# EasyEDA Pro project ProProject_Hi3861_v2.1_2024-07-26.epro, schematic Schematic1

## Sheets
1 P1: Create Date: 2024-06-16; Page Name: P1; Project Name: Hi3861_v2.0; Schematic Name: Schematic1; Update Date: 2024-06-25; Company: 嘉立创EDA; Page Size: A4; Version: V1.0
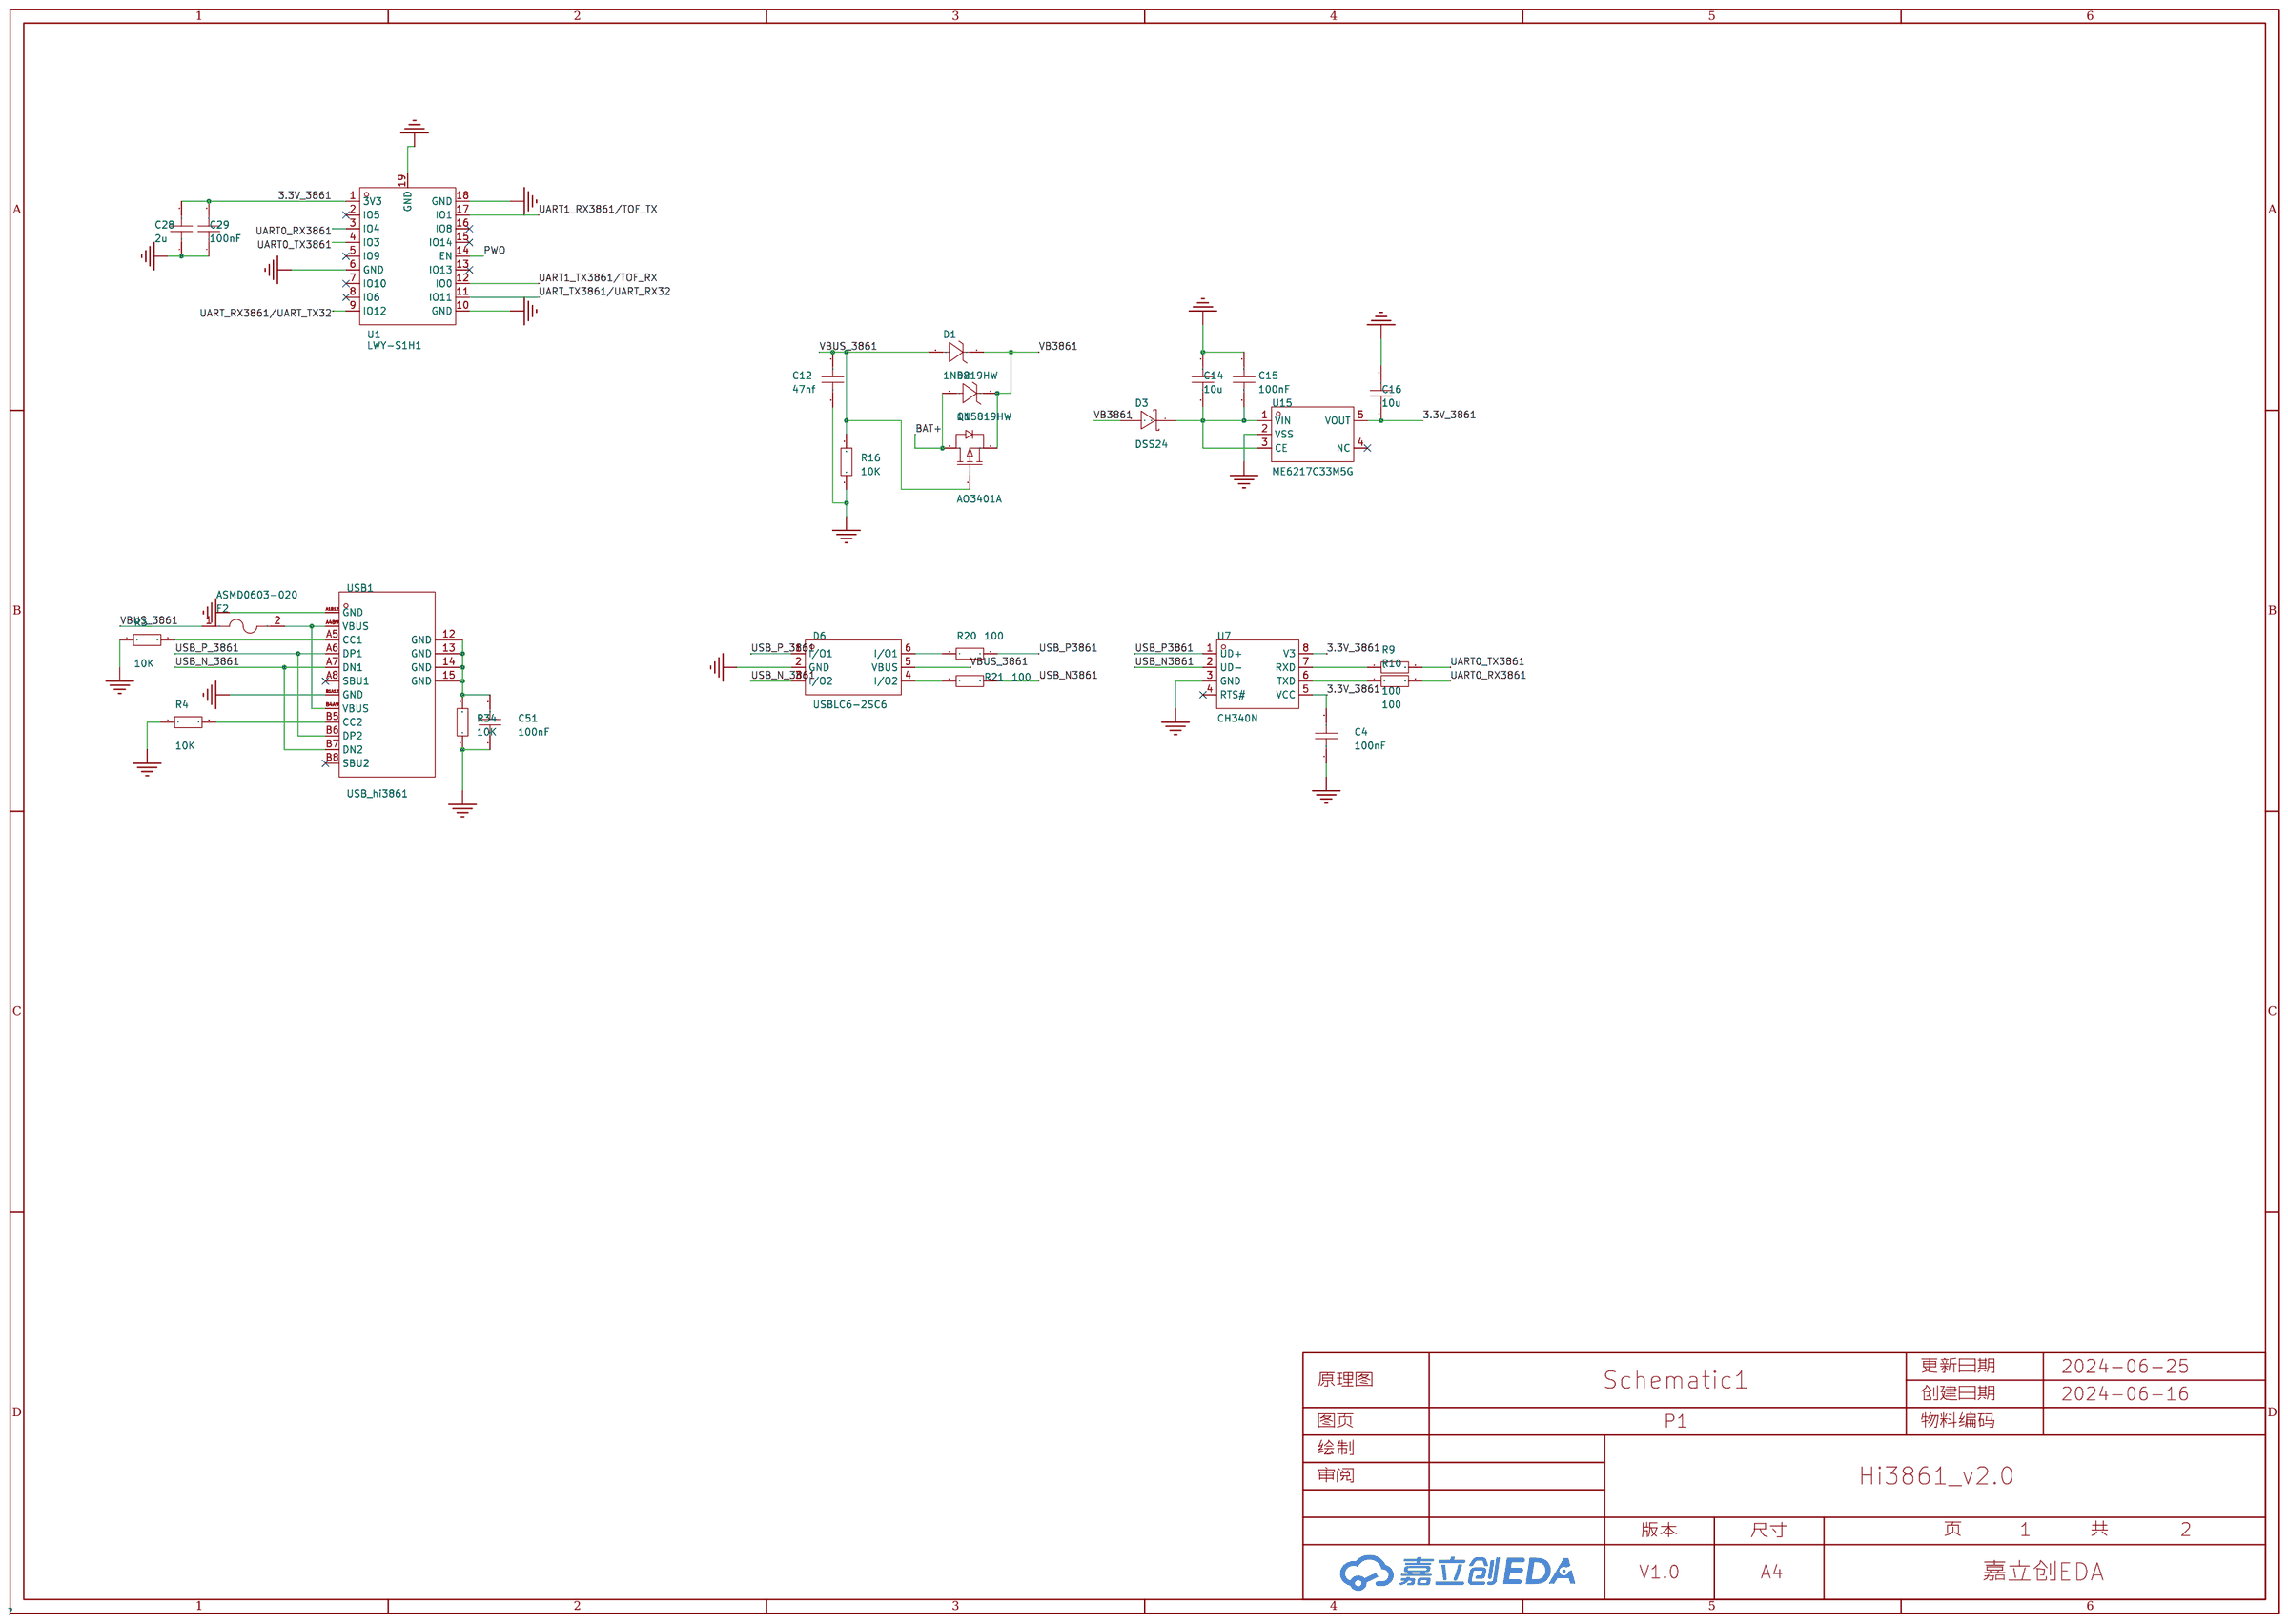
[diagram p0: P1]
2 P2: Create Date: 2024-07-16; Page Name: P2; Project Name: Hi3861_v2.1; Update Date: 2024-07-25
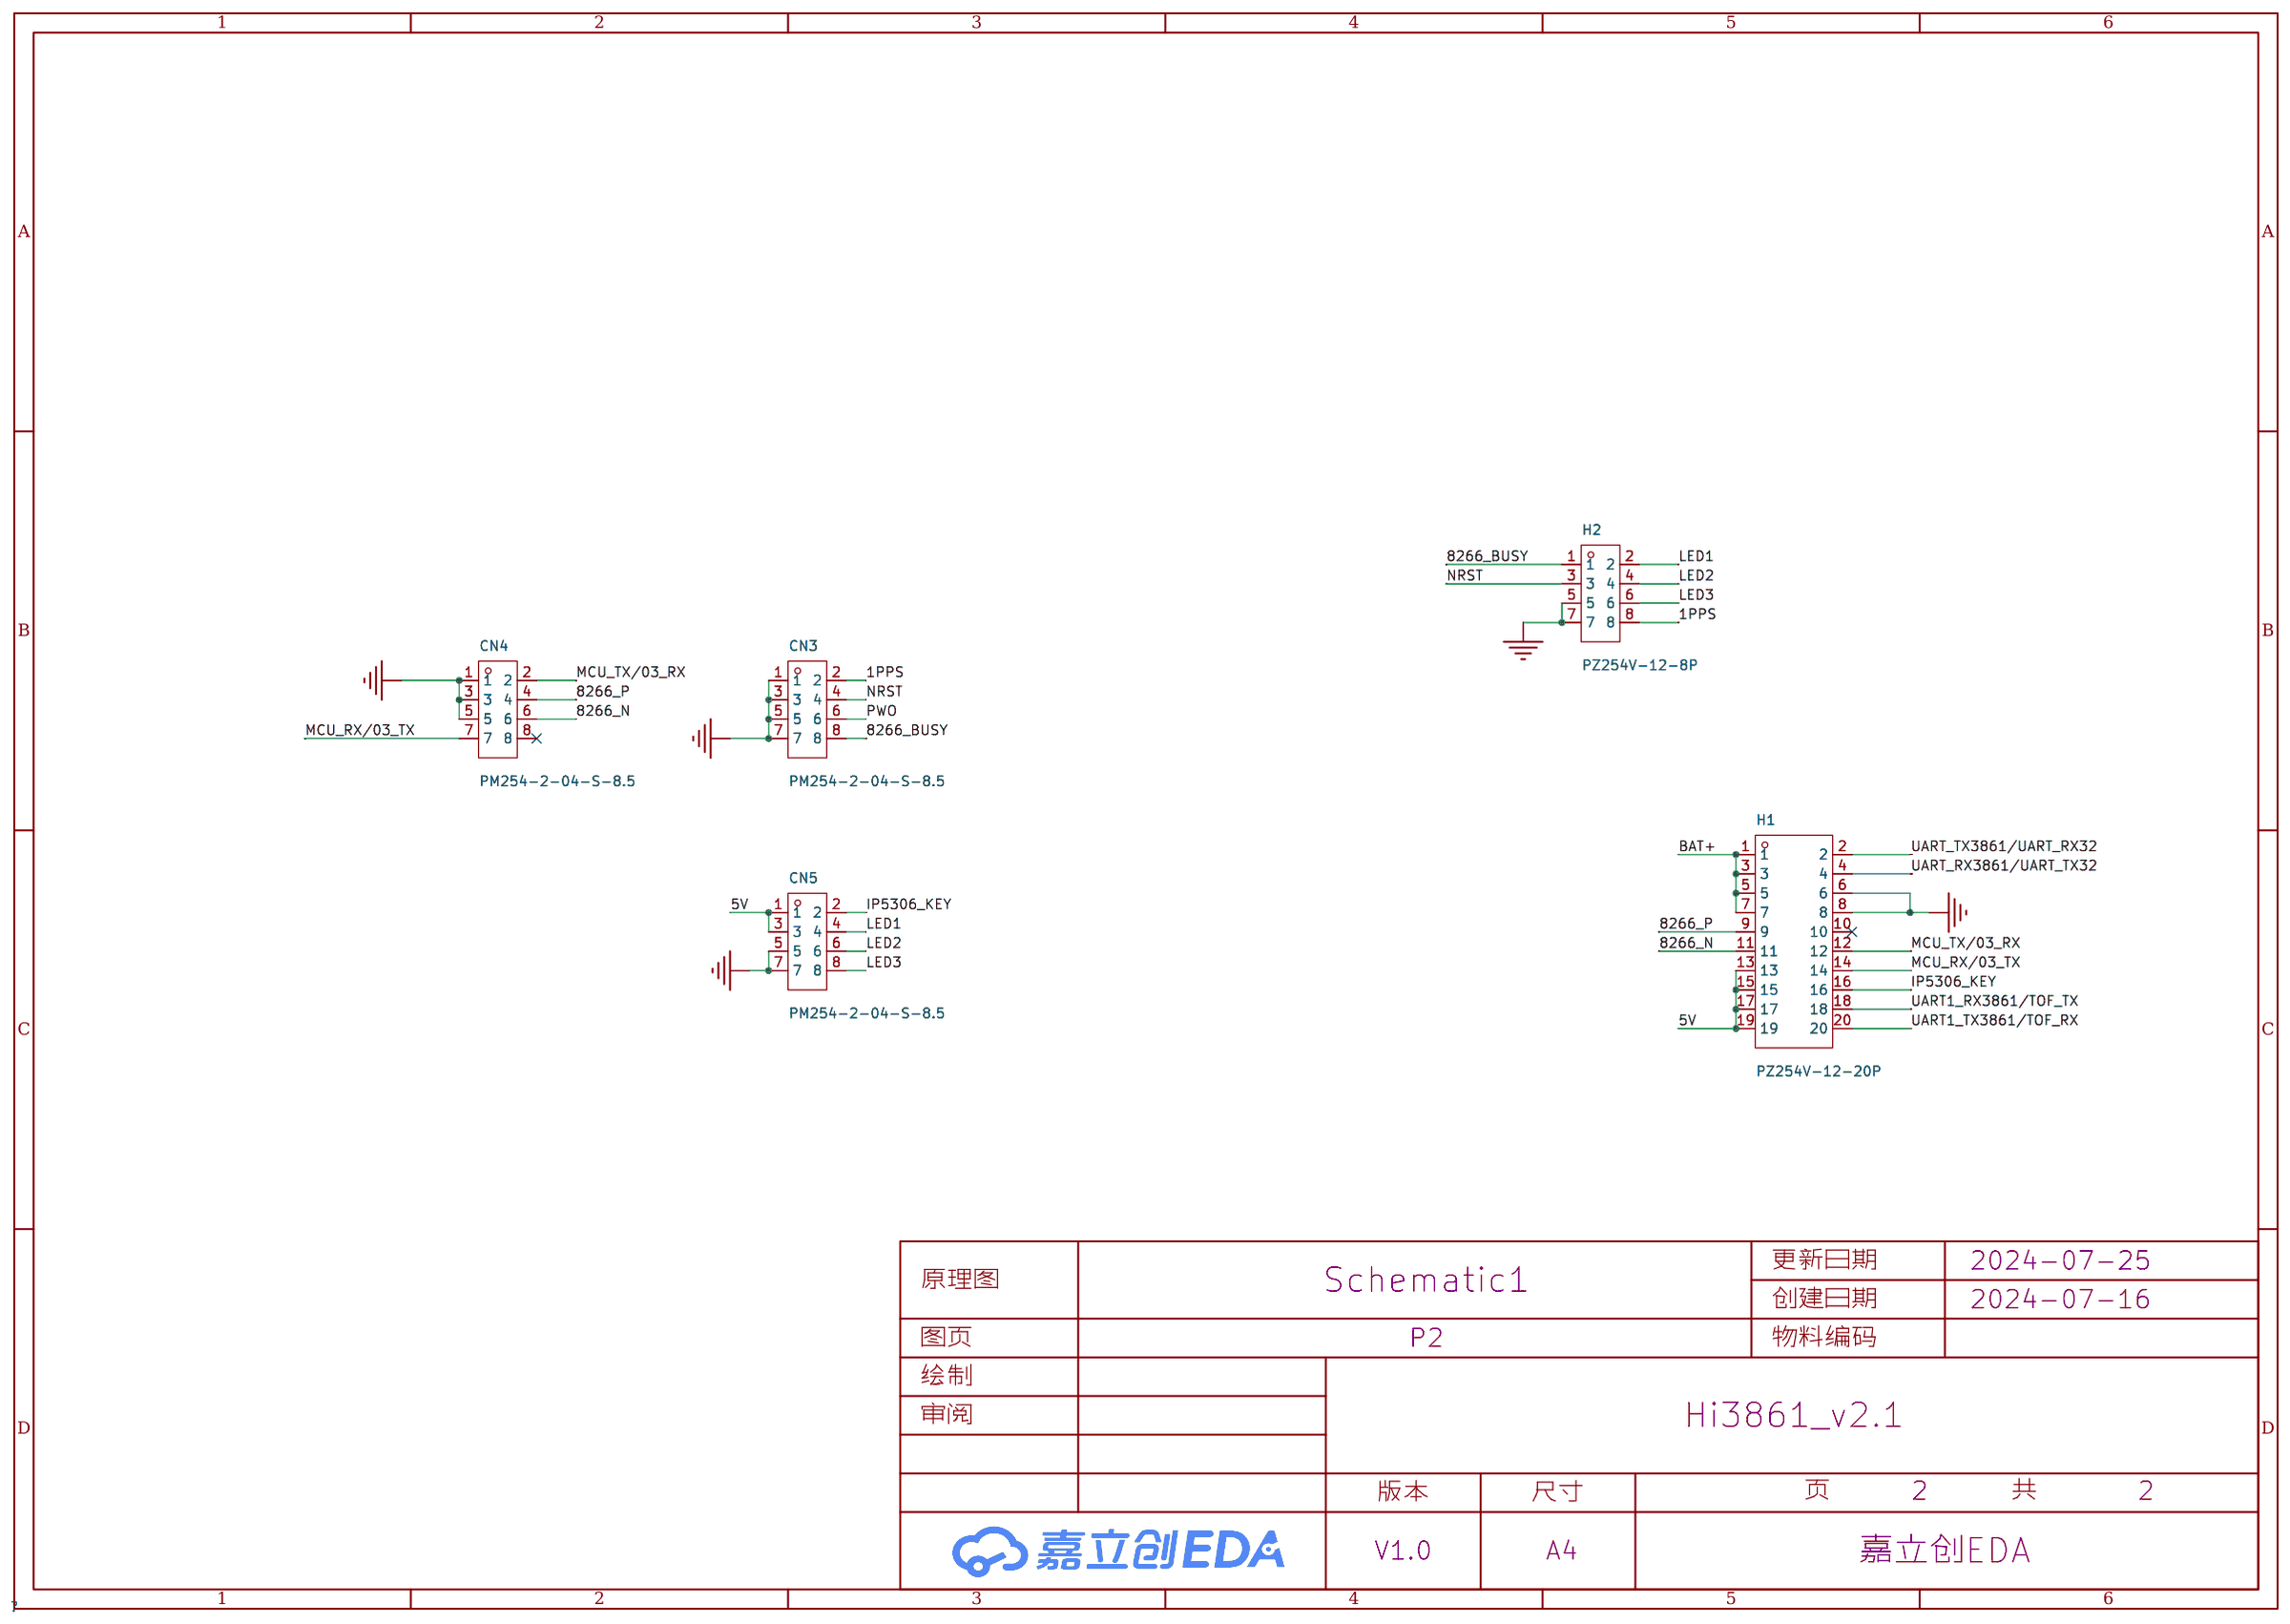
[diagram p1: P2]

## Parts
sheet P1
C4  100nF  [C0402]
C12  47nf  [C0402]
C14  10u  [C0402]
C15  100nF  [C0402]
C16  10u  [C0402]
C28  2u  [C0402]
C29  100nF  [C0402]
C51  100nF  [C0402]
D1  1N5819HW  [SOD-123_L2.7-W1.6-LS3.7-RD-1]
D2  1N5819HW  [SOD-123_L2.7-W1.6-LS3.7-RD-1]
D3  DSS24  [SOD-123_L2.8-W1.8-LS3.7-RD]
D6  USBLC6-2SC6  [SOT-23-6_L2.9-W1.6-P0.95-LS2.8-BL]
F2  ASMD0603-020  [F0603]
Q1  AO3401A  [SOT-23_L2.9-W1.3-P1.90-LS2.4-BR]
R3  10K  [R0402]
R4  10K  [R0402]
R9  100  [R0402]
R10  100  [R0402]
R16  10K  [R0402]
R20  100  [R0402]
R21  100  [R0402]
R34  10K  [R0402]
U1  LWY-S1H1  [WIFIM-SMD_L18.4-W15.0_LWY-S1H1]
U7  CH340N  [SOP-8_L4.9-W3.9-P1.27-LS6.0-BL]
U15  ME6217C33M5G  [SOT-23-5_L3.0-W1.7-P0.95-LS2.8-BR]
USB1  USB_hi3861  [USB-SMD_TYPEC-16PIN]
sheet P2
CN3  PM254-2-04-S-8.5  [HDR-SMD_8P-P2.54-V-F-R2-C4-S7.1]
CN4  PM254-2-04-S-8.5  [HDR-SMD_8P-P2.54-V-F-R2-C4-S7.1]
CN5  PM254-2-04-S-8.5  [HDR-SMD_8P-P2.54-V-F-R2-C4-S7.1]
H1  PZ254V-12-20P  [HDR-TH_20P-P2.54-V-M-R2-C10-S2.54]
H2  PZ254V-12-8P  [HDR-TH_8P-P2.54-V-M-R2-C4-S2.54]

## Library data of the parts
C4 C12 C14-C16 C28 C29 C51 = CAP_0402: Supplier Footprint: 0402
D1 D2 = 1N5819HW_C5439970: Supplier Part: C5439970; Manufacturer: BORN(伯恩半导体); Supplier Footprint: SOD-123; JLCPCB Part Class: 扩展库; Supplier: LCSC
D3 = DSS24: 正向压降(Vf):550mV@2A;直流反向耐压(Vr):40V;平均整流电流(Io):2A;; LCSC Part Name: 电压:40V 电流:2A; Supplier Part: C511865; Manufacturer: BORN(伯恩半导体); Supplier Footprint: SOD-123; Datasheet: https://atta.szlcsc.com/upload/public/pdf/source/20200413/C511865_530A4A8DFA4BF76EA49400B00C28BC33.pdf; Supplier: LCSC; Forward Voltage (Vf@If): 550mV@2A; Reverse Voltage (Vr): 40V; Average Rectified Current (Io): 2A
D6 = USBLC6-2SC6: 最大钳位电压:15V;击穿电压:6V;; Supplier Part: C2687116; Manufacturer: UMW(友台半导体); Supplier Footprint: SOT-23-6; JLCPCB Part Class: 扩展库; Datasheet: https://atta.szlcsc.com/upload/public/pdf/source/20231109/512642D850D9873E7C519F71E85B9A10.pdf; Supplier: LCSC; Maximum Clamping Voltage: 15V; Breakdown Voltage: 6V; Number of Lines: 双路; Type: ESD
F2 = ASMD0603-020: 最大电压:9V;最大电流:40A;保持电流:200mA;跳闸电流:500mA;; LCSC Part Name: 9V 200mA 0603自恢复; Supplier Part: C135321; Manufacturer: JDTfuse(集电通); Supplier Footprint: 0603; JLCPCB Part Class: 扩展库; Datasheet: https://atta.szlcsc.com/upload/public/pdf/source/20230515/E3BD72A3B3566E5D91D9E10B82E096BB.pdf; Supplier: LCSC; Operating Voltage (Max): 9V; Current Rating (Max): 40A; Hold Current: 200mA; Trip Current: 500mA; Power Dissipation: 500mW; Resistance - Initial (Ri) (Min): 550mΩ; Resistance - Post Trip (R1) (Max): 3.5Ω; Maximum Time to Trip: 600ms; Operating Temperature: -40℃~+85℃
Q1 = AO3401A_C15127: 类型:1个P沟道;漏源电压(Vdss):30V;连续漏极电流(Id):4A;功率(Pd):1.4W;导通电阻(RDS(on)@Vgs,Id):44mΩ@10V,4.3A;阈值电压(Vgs(th)@Id):1.3V@250uA;; LCSC Part Name: 1个P沟道 耐压:30V 电流:4A; Supplier Part: C15127; Manufacturer: AOS; Supplier Footprint: SOT-23; JLCPCB Part Class: 基础库; Datasheet: https://atta.szlcsc.com/upload/public/pdf/source/20160507/1462613609053.pdf; Supplier: LCSC; Type: 1个P沟道; Drain Source Voltage (Vdss): 30V; Continuous Drain Current (Id): 4A; Power Dissipation (Pd): 1.4W; Drain Source On Resistance (RDS(on)@Vgs,Id): 44mΩ@10V,4.3A; Gate Threshold Voltage (Vgs(th)@Id): 1.3V@250uA; Total Gate Charge (Qg@Vgs): 12.2nC@4.5V; Input Capacitance (Ciss@Vds): 1.2nF@15V; Operating Temperature: -55℃~+150℃@(Tj)
R3 R4 R9 R10 R16 R20 R21 R34 = Res_0402: Supplier Footprint: 0402
U1 = LWY-S1H1: Supplier Part: C9900021092; Supplier Footprint: LCC-18_L18.6-W15.0-P1.50; JLCPCB Part Class: 扩展库; Supplier: LCSC
U7 = CH340N: LCSC Part Name: USB转串口芯片 CH340; Supplier Part: C2977777; Manufacturer: WCH(南京沁恒); Supplier Footprint: SOP-8; Datasheet: https://atta.szlcsc.com/upload/public/pdf/source/20230530/6E401E9554E9F5311886CC8B3F89B62E.pdf; Supplier: LCSC
U15 = ME6217C33M5G: 输出类型:固定;最大输入电压:7V;输出电压:3.3V;最大输出电流:800mA;电源纹波抑制比(PSRR):65dB@(1kHz);输出极性:正极;; LCSC Part Name: 输入7V 输出3.3V 800mA; Supplier Part: C427602; Manufacturer: MICRONE(南京微盟); Supplier Footprint: SOT-23-5; JLCPCB Part Class: 扩展库; Datasheet: https://atta.szlcsc.com/upload/public/pdf/source/20190910/C427602_D4B9162A2E9D9EF57C60010DFDECEF37.pdf; Supplier: LCSC; Output Type: 固定; Maximum Input Voltage: 7V; Output Voltage: 3.3V; MAX Output Current: 800mA; Power Supply Rejection Ratio (PSRR): 65dB@(1kHz); Dropout Voltage: 180mV@(300mA); Output Polarity: 正极; Number of Outputs: 1
USB1 = CONNECTOR,USB,TYPEC,RTANG,16PIN: Supplier Part: C9900022254; Supplier Footprint: USBTypeC; JLCPCB Part Class: 扩展库; Supplier: LCSC
CN3-CN5 = PM254-2-04-S-8.5: 插孔结构:2x4P;间距:2.54mm;行距:2.54mm;圆孔/方孔:方孔;安装类型:立贴;排数:双排;总孔位数:8P;额定电流:3A;插孔方向:顶部;塑高:8.5mm;触头材质:铜合金;工作温度范围:-40℃~+105℃;焊接温度(最大值):260℃@5S;; LCSC Part Name: 2x4P 间距:2.54mm 立贴; Supplier Part: C3975149; Manufacturer: HCTL(华灿天禄); Supplier Footprint: SMD,P=2.54mm; Datasheet: https://atta.szlcsc.com/upload/public/pdf/source/20230609/7C6F8D8E301C6BBC8F19D55951C36597.pdf; Supplier: LCSC; Holes Structure: 2x4P; Pitch: 2.54mm; Row Spacing: 2.54mm; Circular Hole / Square Hole: 方孔; Mounting Type: 立贴; Number of Rows: 双排; Number of Holes: 8P; Current Rating (Max): 3A; Holes Direction: 顶部; Insulation Height: 8.5mm; Contact Material: 铜合金; Operating Temperature Range: -40℃~+105℃; Soldering Temperature(Max): 260℃@5S
H1 = PZ254V-12-20P: 插针结构:2x10P;间距:2.54mm;行距:2.54mm;圆针/方针:方针;安装类型:直插;排数:双排;总PIN位数:20P;额定电流:-;额定电压:-;配合针长度:6mm;塑高:2.5mm;端接针长度:3mm;触头材质:黄铜;触头镀层:-;工作温度范围:-40℃~+105℃;颜色:黑色;; LCSC Part Name: 间距:2.54mm 2x10P 直插 方针; Supplier Part: C492427; Manufacturer: XFCN(兴飞); Supplier Footprint: 插件,P=2.54mm; Datasheet: https://atta.szlcsc.com/upload/public/pdf/source/20200309/C492427_9411E93D35F2EC20CED9A3ED9F4BBE60.pdf; Supplier: LCSC; Pin Structure: 2x10P; Pitch: 2.54mm; Row Spacing: 2.54mm; Circluar Pins/Square Pins: 方针; Mounting Type: 直插; Number of Rows: 双排; Number of Pins: 20P; Length of Mating Pin: 6mm; Insulation Height: 2.5mm; Length of End Connection Pin: 3mm; Contact Material: 黄铜; Operating Temperature Range: -40℃~+105℃; Color: 黑色
H2 = PZ254V-12-8P: 插针结构:2x4P;间距:2.54mm;行距:2.54mm;圆针/方针:方针;安装类型:直插;排数:双排;总PIN位数:8P;额定电流:-;额定电压:-;配合针长度:6mm;塑高:2.5mm;端接针长度:3mm;触头材质:黄铜;触头镀层:-;工作温度范围:-40℃~+105℃;颜色:黑色;; LCSC Part Name: 间距:2.54mm 2x4P 直插 方针; Supplier Part: C492421; Manufacturer: XFCN(兴飞); Supplier Footprint: 插件,P=2.54mm; Datasheet: https://atta.szlcsc.com/upload/public/pdf/source/20200309/C492421_DC8A206AF99CD7755BD4A5B0BC48200B.pdf; Supplier: LCSC; Pin Structure: 2x4P; Pitch: 2.54mm; Row Spacing: 2.54mm; Circluar Pins/Square Pins: 方针; Mounting Type: 直插; Number of Rows: 双排; Number of Pins: 8P; Length of Mating Pin: 6mm; Insulation Height: 2.5mm; Length of End Connection Pin: 3mm; Contact Material: 黄铜; Operating Temperature Range: -40℃~+105℃; Color: 黑色

## Nets
3.3V_3861: C4.2 C16.1 C28.2 C29.2 U1.1(3V3) U7.5(VCC) U7.8(V3) U15.5(VOUT)
5V: CN5.1 CN5.3 H1.13 H1.15 H1.17 H1.19
GND: C4.1 C12.1 C14.2 C15.2 C16.2 C28.1 C29.1 C51.1 CN3.1 CN3.3 CN3.5 CN3.7 CN4.1 CN4.3 CN4.5 CN5.5 CN5.7 D6.2(GND) H1.6 H1.8 H2.5 H2.7 R3.1 R4.1 R16.1 R34.1 U1.6(GND) U1.10(GND) U1.18(GND) U1.19(GND) U7.3(GND) U15.2(VSS) USB1.A1B12(GND) USB1.B1A12(GND)
VBUS_3861: C12.2 D1.2(A) D6.5(VBUS) F2.1 Q1.1(G) R16.2
1PPS: CN3.2 H2.8
8266_BUSY: CN3.8 H2.1
8266_N: CN4.6 H1.11
8266_P: CN4.4 H1.9
BAT+: D2.2(A) H1.1 H1.3 H1.5 H1.7 Q1.3(D)
IP5306_KEY: CN5.2 H1.16
LED1: CN5.4 H2.2
LED2: CN5.6 H2.4
LED3: CN5.8 H2.6
MCU_RX/03_TX: CN4.7 H1.14
MCU_TX/03_RX: CN4.2 H1.12
NRST: CN3.4 H2.3
PWO: CN3.6 U1.14(EN)
UART0_RX3861: R10.2 U1.3(IO4)
UART0_TX3861: R9.2 U1.4(IO3)
UART1_RX3861/TOF_TX: H1.18 U1.17(IO1)
UART1_TX3861/TOF_RX: H1.20 U1.12(IO0)
UART_RX3861/UART_TX32: H1.4 U1.9(IO12)
UART_TX3861/UART_RX32: H1.2 U1.11(IO11)
USB_N3861: R21.2 U7.2(UD-)
USB_N_3861: D6.3(I/O2) USB1.A7(DN1) USB1.B7(DN2)
USB_P3861: R20.2 U7.1(UD+)
USB_P_3861: D6.1(I/O1) USB1.A6(DP1) USB1.B6(DP2)
VB3861: D1.1(K) D2.1(K) D3.2(A) Q1.2(S)
$1N1594: R4.2 USB1.B5(CC2)
$1N1597: R3.2 USB1.A5(CC1)
$1N1598: F2.2 USB1.A4B9(VBUS) USB1.B4A9(VBUS)
$1N1606: C51.2 R34.2 USB1.12(GND) USB1.13(GND) USB1.14(GND) USB1.15(GND)
$1N1725: D6.6(I/O1) R20.1
$1N1728: D6.4(I/O2) R21.1
$1N1923: C14.1 C15.1 D3.1(C) U15.1(VIN) U15.3(CE)
$1N2088: R9.1 U7.7(RXD)
$1N2091: R10.1 U7.6(TXD)

Not connected (* = marked no-connect by the designer): CN4 8*; H1 10*; U1 2(IO5)* 5(IO9)* 7(IO10)* 8(IO6)* 13(IO13)* 15(IO14)* 16(IO8)*; U7 4(RTS#)*; U15 4(NC)*; USB1 A8(SBU1)* B8(SBU2)*
